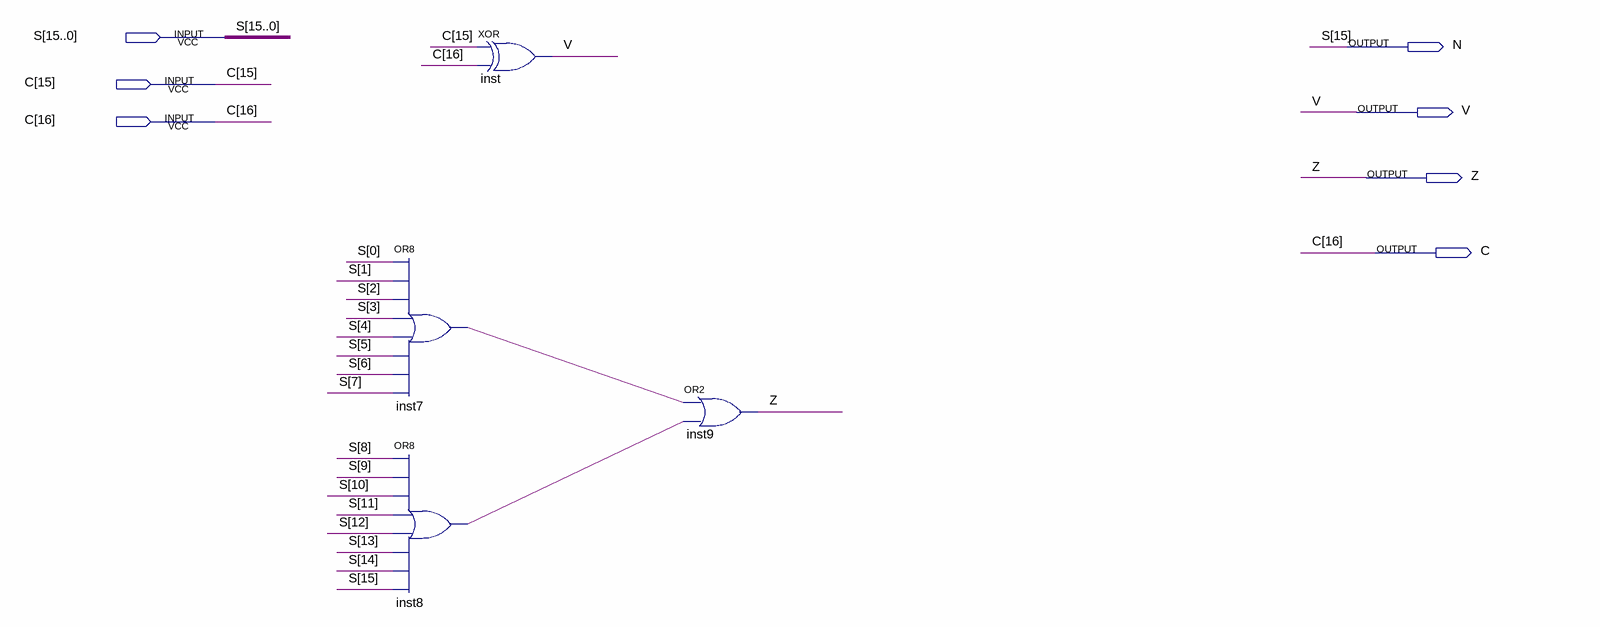
[diagram p0: schematic sheet]
// Quartus schematic LogicFlags.bdf as structural Verilog: 4 symbols, 7 pins
module LogicFlags (
  input  [15:0] S,
  input  [16:15] C,
  output N,
  output V,
  output Z,
  output C_1bit
);

  wire inst7_out, inst8_out;

  or inst7 (inst7_out, S[0], S[1], S[2], S[3], S[4], S[5], S[6], S[7]);
  or inst8 (inst8_out, S[8], S[9], S[10], S[11], S[12], S[13], S[14], S[15]);
  xor inst (V, C[15], C[16]);
  or inst9 (Z, inst7_out, inst8_out);

  assign C_1bit = C[16];
  assign N = S[15];
endmodule
